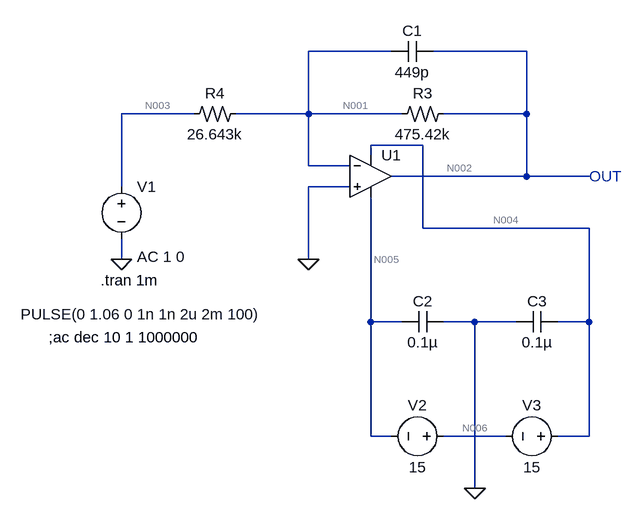
[diagram p0: schematic 1.asc]
1.asc, the LTspice schematic file:
Version 4
SHEET 1 884 680
WIRE 528 -48 400 -48
WIRE 736 -48 592 -48
WIRE 224 48 112 48
WIRE 400 48 400 -48
WIRE 400 48 288 48
WIRE 544 48 400 48
WIRE 736 48 736 -48
WIRE 736 48 608 48
WIRE 576 96 496 96
WIRE 496 112 496 96
WIRE 400 128 400 48
WIRE 464 128 400 128
WIRE 736 144 736 48
WIRE 736 144 528 144
WIRE 832 144 736 144
WIRE 112 160 112 48
WIRE 464 160 400 160
WIRE 576 224 576 96
WIRE 832 224 576 224
WIRE 112 272 112 240
WIRE 400 272 400 160
WIRE 496 368 496 176
WIRE 544 368 496 368
WIRE 656 368 608 368
WIRE 720 368 656 368
WIRE 832 368 832 224
WIRE 832 368 784 368
WIRE 496 544 496 368
WIRE 528 544 496 544
WIRE 704 544 608 544
WIRE 832 544 832 368
WIRE 832 544 784 544
WIRE 656 624 656 368
FLAG 112 272 0
FLAG 400 272 0
FLAG 656 624 0
SYMBOL Opamps\\UniversalOpamp2 496 144 R0
SYMATTR InstName U1
SYMATTR Value2 Avol=0.1Meg GBW=4Meg Slew=13Meg
SYMATTR SpiceLine2 en=0 enk=0 in=0 ink=0 Rin=1T
SYMBOL cap 592 -64 R90
WINDOW 0 0 32 VBottom 2
WINDOW 3 32 32 VTop 2
SYMATTR InstName C1
SYMATTR Value 449p
SYMBOL res2 608 32 R90
WINDOW 0 0 32 VBottom 2
WINDOW 3 32 32 VTop 2
SYMATTR InstName R3
SYMATTR Value 475.42k
SYMBOL res2 288 32 R90
WINDOW 0 0 32 VBottom 2
WINDOW 3 32 32 VTop 2
SYMATTR InstName R4
SYMATTR Value 26.643k
SYMBOL cap 608 352 R90
WINDOW 0 0 32 VBottom 2
WINDOW 3 32 32 VTop 2
SYMATTR InstName C2
SYMATTR Value 0.1µ
SYMBOL cap 784 352 R90
WINDOW 0 0 32 VBottom 2
WINDOW 3 32 32 VTop 2
SYMATTR InstName C3
SYMATTR Value 0.1µ
SYMBOL voltage 624 544 R90
WINDOW 0 -32 56 VBottom 2
WINDOW 3 32 56 VTop 2
WINDOW 123 0 0 Left 0
WINDOW 39 0 0 Left 0
SYMATTR InstName V2
SYMATTR Value 15
SYMBOL voltage 800 544 R90
WINDOW 0 -32 56 VBottom 2
WINDOW 3 32 56 VTop 2
WINDOW 123 0 0 Left 0
WINDOW 39 0 0 Left 0
SYMATTR InstName V3
SYMATTR Value 15
SYMBOL voltage 112 144 R0
WINDOW 123 24 124 Left 2
WINDOW 39 0 0 Left 0
WINDOW 3 -155 212 Left 2
SYMATTR Value2 AC 1 0
SYMATTR Value PULSE(0 1.06 0 1n 1n 2u 2m 100)
SYMATTR InstName V1
TEXT 832 144 Left 2 ;OUT
TEXT 80 304 Left 2 !.tran 1m
TEXT 0 392 Left 2 !;ac dec 10 1 1000000

The netlist it stands for:
* 1.asc
XU1 0 N001 N004 N005 N002 level.2 Avol=0.1Meg GBW=4Meg Slew=13Meg ilimit=25m rail=0 Vos=0 phimargin=45 en=0 enk=0 in=0 ink=0 Rin=1T  ; pins IN+ IN- V+ V- OUT
C1 N002 N001 449p
R3 N002 N001 475.42k
R4 N001 N003 26.643k
C2 0 N005 0.1µ
C3 N004 0 0.1µ
V2 N006 N005 15
V3 N004 N006 15
V1 N003 0 PULSE(0 1.06 0 1n 1n 2u 2m 100) AC 1 0
* OUT
.tran 1m
;ac dec 10 1 1000000
.lib UniversalOpamps2.sub
.backanno
.end

* Results of the author's LTspice run, read from the files saved beside the schematic
* Operating Point, zero values left out:
*   V(n004) = 15 V
*   V(n005) = -15 V
*   I(V3) = -1.498 mA
*   I(V2) = -1.498 mA
*   Ix(u1:3) = 1.498 mA
*   Ix(u1:4) = -1.498 mA
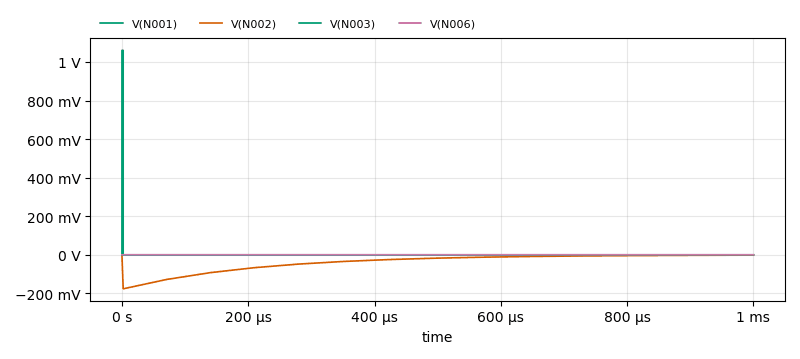
[diagram p1: Transient Analysis of 1.asc, plotted from the saved traces]
* Transient Analysis, 1 run:
*   V(N001): min -14.24 µV, max 1.411 mV, average 7.659 nV, rms 62.68 µV, last -121.4 nV
*   V(N002): min -176.2 mV, max 287.9 µV, average -37.83 mV, rms 58.85 mV, last -1.654 mV
*   V(N003): min 0 V, max 1.06 V, average 2.121 mV, rms 47.42 mV, last 0 V
*   V(N006): min 53.9 pV, max 397.5 µV, average 396 µV, rms 396.2 µV, last 396.1 µV